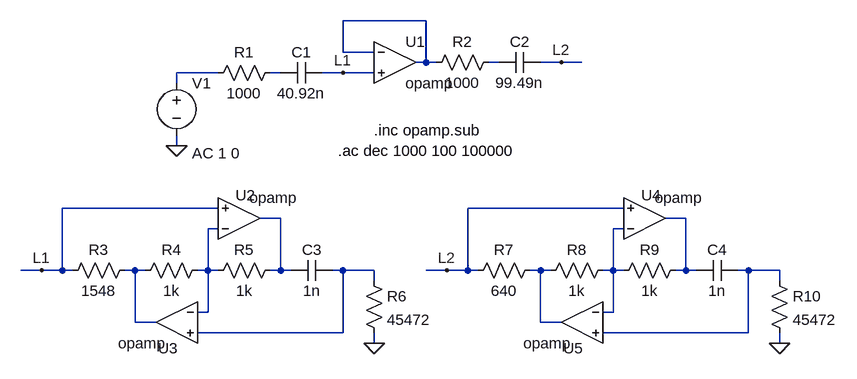
[diagram p0: schematic MP_Orden4_BobinasGIC.asc]
MP_Orden4_BobinasGIC.asc, the LTspice schematic file:
Version 4
SHEET 1 1168 680
WIRE 528 16 400 16
WIRE 400 64 400 16
WIRE 448 64 400 64
WIRE 528 80 528 16
WIRE 528 80 512 80
WIRE 544 80 528 80
WIRE 640 80 624 80
WIRE 736 80 704 80
WIRE 768 80 736 80
WIRE 208 96 144 96
WIRE 304 96 288 96
WIRE 400 96 368 96
WIRE 448 96 400 96
WIRE 144 112 144 96
WIRE 144 208 144 192
WIRE 208 304 -32 304
WIRE 832 304 592 304
WIRE 304 320 272 320
WIRE 928 320 896 320
WIRE 208 336 192 336
WIRE 832 336 816 336
WIRE -64 400 -96 400
WIRE -32 400 -32 304
WIRE -32 400 -64 400
WIRE -16 400 -32 400
WIRE 80 400 64 400
WIRE 96 400 80 400
WIRE 192 400 192 336
WIRE 192 400 176 400
WIRE 208 400 192 400
WIRE 304 400 304 320
WIRE 304 400 288 400
WIRE 320 400 304 400
WIRE 400 400 384 400
WIRE 448 400 400 400
WIRE 560 400 528 400
WIRE 592 400 592 304
WIRE 592 400 560 400
WIRE 608 400 592 400
WIRE 704 400 688 400
WIRE 720 400 704 400
WIRE 816 400 816 336
WIRE 816 400 800 400
WIRE 832 400 816 400
WIRE 928 400 928 320
WIRE 928 400 912 400
WIRE 944 400 928 400
WIRE 1024 400 1008 400
WIRE 1072 400 1024 400
WIRE 448 416 448 400
WIRE 1072 416 1072 400
WIRE 192 464 192 400
WIRE 192 464 176 464
WIRE 816 464 816 400
WIRE 816 464 800 464
WIRE 80 480 80 400
WIRE 112 480 80 480
WIRE 704 480 704 400
WIRE 736 480 704 480
WIRE 400 496 400 400
WIRE 400 496 176 496
WIRE 1024 496 1024 400
WIRE 1024 496 800 496
WIRE 448 512 448 496
WIRE 1072 512 1072 496
FLAG 144 208 0
FLAG 448 512 0
FLAG 1072 512 0
FLAG -64 400 L1
FLAG 400 96 L1
FLAG 736 80 L2
FLAG 560 400 L2
SYMBOL res 304 80 R90
WINDOW 0 0 56 VBottom 2
WINDOW 3 32 56 VTop 2
SYMATTR InstName R1
SYMATTR Value 1000
SYMBOL cap 368 80 R90
WINDOW 0 0 32 VBottom 2
WINDOW 3 32 32 VTop 2
SYMATTR InstName C1
SYMATTR Value 40.92n
SYMBOL Opamps\\opamp 480 16 R0
SYMATTR InstName U1
SYMBOL res 640 64 R90
WINDOW 0 0 56 VBottom 2
WINDOW 3 32 56 VTop 2
SYMATTR InstName R2
SYMATTR Value 1000
SYMBOL cap 704 64 R90
WINDOW 0 0 32 VBottom 2
WINDOW 3 32 32 VTop 2
SYMATTR InstName C2
SYMATTR Value 99.49n
SYMBOL voltage 144 96 R0
WINDOW 123 24 124 Left 2
WINDOW 39 0 0 Left 0
SYMATTR Value2 AC 1 0
SYMATTR InstName V1
SYMATTR Value ""
SYMBOL Opamps\\opamp 240 384 M180
WINDOW 0 -5 100 Left 2
SYMATTR InstName U2
SYMBOL Opamps\\opamp 144 416 M0
WINDOW 0 -2 104 Left 2
SYMATTR InstName U3
SYMBOL res 80 384 R90
WINDOW 0 0 56 VBottom 2
WINDOW 3 32 56 VTop 2
SYMATTR InstName R3
SYMATTR Value 1548
SYMBOL res 192 384 R90
WINDOW 0 0 56 VBottom 2
WINDOW 3 32 56 VTop 2
SYMATTR InstName R4
SYMATTR Value 1k
SYMBOL res 304 384 R90
WINDOW 0 0 56 VBottom 2
WINDOW 3 32 56 VTop 2
SYMATTR InstName R5
SYMATTR Value 1k
SYMBOL cap 384 384 R90
WINDOW 0 0 32 VBottom 2
WINDOW 3 32 32 VTop 2
SYMATTR InstName C3
SYMATTR Value 1n
SYMBOL res 432 400 R0
SYMATTR InstName R6
SYMATTR Value 45472
SYMBOL Opamps\\opamp 864 384 M180
WINDOW 0 -5 100 Left 2
SYMATTR InstName U4
SYMBOL Opamps\\opamp 768 416 M0
WINDOW 0 -2 104 Left 2
SYMATTR InstName U5
SYMBOL res 704 384 R90
WINDOW 0 0 56 VBottom 2
WINDOW 3 32 56 VTop 2
SYMATTR InstName R7
SYMATTR Value 640
SYMBOL res 816 384 R90
WINDOW 0 0 56 VBottom 2
WINDOW 3 32 56 VTop 2
SYMATTR InstName R8
SYMATTR Value 1k
SYMBOL res 928 384 R90
WINDOW 0 0 56 VBottom 2
WINDOW 3 32 56 VTop 2
SYMATTR InstName R9
SYMATTR Value 1k
SYMBOL cap 1008 384 R90
WINDOW 0 0 32 VBottom 2
WINDOW 3 32 32 VTop 2
SYMATTR InstName C4
SYMATTR Value 1n
SYMBOL res 1056 400 R0
SYMATTR InstName R10
SYMATTR Value 45472
TEXT 448 184 Left 2 !.inc opamp.sub
TEXT 392 216 Left 2 !.ac dec 1000 100 100000

The netlist it stands for:
* MP_Orden4_BobinasGIC.asc
R1 N004 N003 1000
C1 L1 N004 40.92n
XU1 N001 L1 N001 opamp Aol=100K GBW=10Meg  ; pins invin noninvin out
R2 N002 N001 1000
C2 L2 N002 99.49n
V1 N003 0 AC 1 0
XU2 N007 L1 N005 opamp Aol=100K GBW=10Meg  ; pins invin noninvin out
XU3 N007 N010 N009 opamp Aol=100K GBW=10Meg  ; pins invin noninvin out
R3 N009 L1 1548
R4 N007 N009 1k
R5 N005 N007 1k
C3 N010 N005 1n
R6 N010 0 45472
XU4 N008 L2 N006 opamp Aol=100K GBW=10Meg  ; pins invin noninvin out
XU5 N008 N012 N011 opamp Aol=100K GBW=10Meg  ; pins invin noninvin out
R7 N011 L2 640
R8 N008 N011 1k
R9 N006 N008 1k
C4 N012 N006 1n
R10 N012 0 45472
.inc opamp.sub
.ac dec 1000 100 100000
.backanno
.end